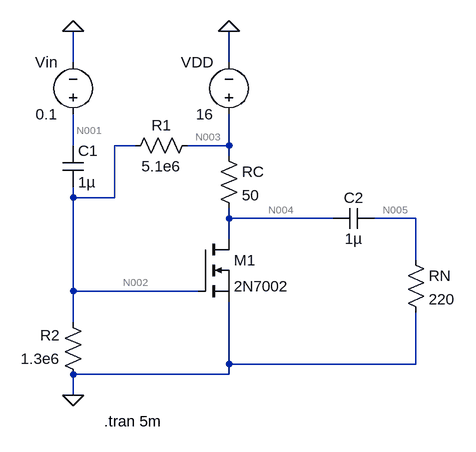
[diagram p0: schematic lab3_task3.asc]
lab3_task3.asc, the LTspice schematic file:
Version 4
SHEET 1 880 680
WIRE 192 16 192 -32
WIRE 432 16 432 -32
WIRE 192 144 192 96
WIRE 288 144 256 144
WIRE 432 144 432 96
WIRE 432 144 368 144
WIRE 432 160 432 144
WIRE 192 224 192 208
WIRE 256 224 256 144
WIRE 256 224 192 224
WIRE 432 256 432 240
WIRE 592 256 432 256
WIRE 720 256 656 256
WIRE 432 288 432 256
WIRE 720 320 720 256
WIRE 192 368 192 224
WIRE 384 368 192 368
WIRE 192 416 192 368
WIRE 432 480 432 384
WIRE 720 480 720 400
WIRE 720 480 432 480
WIRE 432 496 432 480
WIRE 432 496 192 496
WIRE 192 528 192 496
FLAG 192 528 0
FLAG 432 -32 0
FLAG 192 -32 0
SYMBOL voltage 192 112 R180
WINDOW 0 24 96 Left 2
WINDOW 3 24 16 Left 2
WINDOW 123 0 0 Left 0
WINDOW 39 0 0 Left 0
SYMATTR InstName Vin
SYMATTR Value 0.1
SYMBOL voltage 432 112 R180
WINDOW 0 24 96 Left 2
WINDOW 3 24 16 Left 2
WINDOW 123 0 0 Left 0
WINDOW 39 0 0 Left 0
SYMATTR InstName VDD
SYMATTR Value 16
SYMBOL res 416 144 R0
SYMATTR InstName RC
SYMATTR Value 50
SYMBOL nmos 384 288 R0
SYMATTR InstName M1
SYMATTR Value 2N7002
SYMBOL cap 176 144 R0
SYMATTR InstName C1
SYMATTR Value 1µ
SYMBOL res 384 128 R90
WINDOW 0 0 56 VBottom 2
WINDOW 3 32 56 VTop 2
SYMATTR InstName R1
SYMATTR Value 5.1e6
SYMBOL res 208 512 R180
WINDOW 0 36 76 Left 2
WINDOW 3 36 40 Left 2
SYMATTR InstName R2
SYMATTR Value 1.3e6
SYMBOL cap 656 240 R90
WINDOW 0 0 32 VBottom 2
WINDOW 3 32 32 VTop 2
SYMATTR InstName C2
SYMATTR Value 1µ
SYMBOL res 704 304 R0
SYMATTR InstName RN
SYMATTR Value 220
TEXT 240 568 Left 2 !.tran 5m

The netlist it stands for:
* lab3_task3.asc
Vin N001 0 0.1
VDD N003 0 16
RC N003 N004 50
M1 N004 N002 0 0 2N7002
C1 N001 N002 1µ
R1 N003 N002 5.1e6
R2 0 N002 1.3e6
C2 N005 N004 1µ
RN N005 0 220
.model NMOS NMOS
.model PMOS PMOS
.lib standard.mos
.tran 5m
.backanno
.end

* Results of the author's LTspice run, read from the files saved beside the schematic
* Operating Point, zero values left out:
*   V(n001) = 100 mV
*   V(n003) = 16 V
*   V(n004) = 6.367 V
*   V(n002) = 3.25 V
*   Id(M1) = 192.7 mA
*   Is(M1) = -192.7 mA
*   I(R2) = -2.5 µA
*   I(R1) = 2.5 µA
*   I(Rc) = 192.7 mA
*   I(Vdd) = -192.7 mA
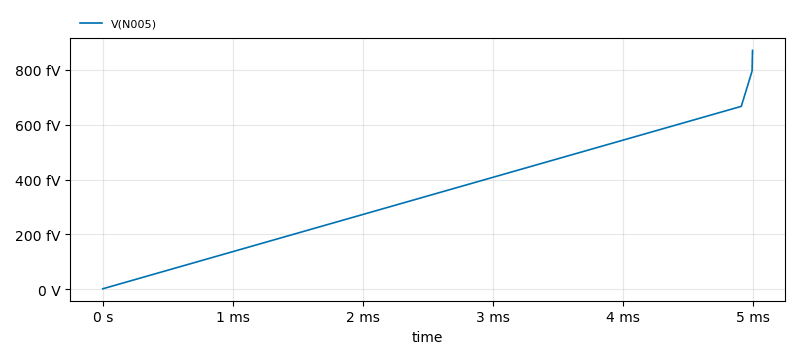
[diagram p1: Transient Analysis of lab3_task3.asc, plotted from the saved traces]
* Transient Analysis, 1 run:
*   V(N005): min 1.401 fV, max 871.3 fV, average 341.1 fV, rms 477.5 fV, last 871.3 fV